# EAGLE board Farmduino_bêta (EAGLE 7.2.0)
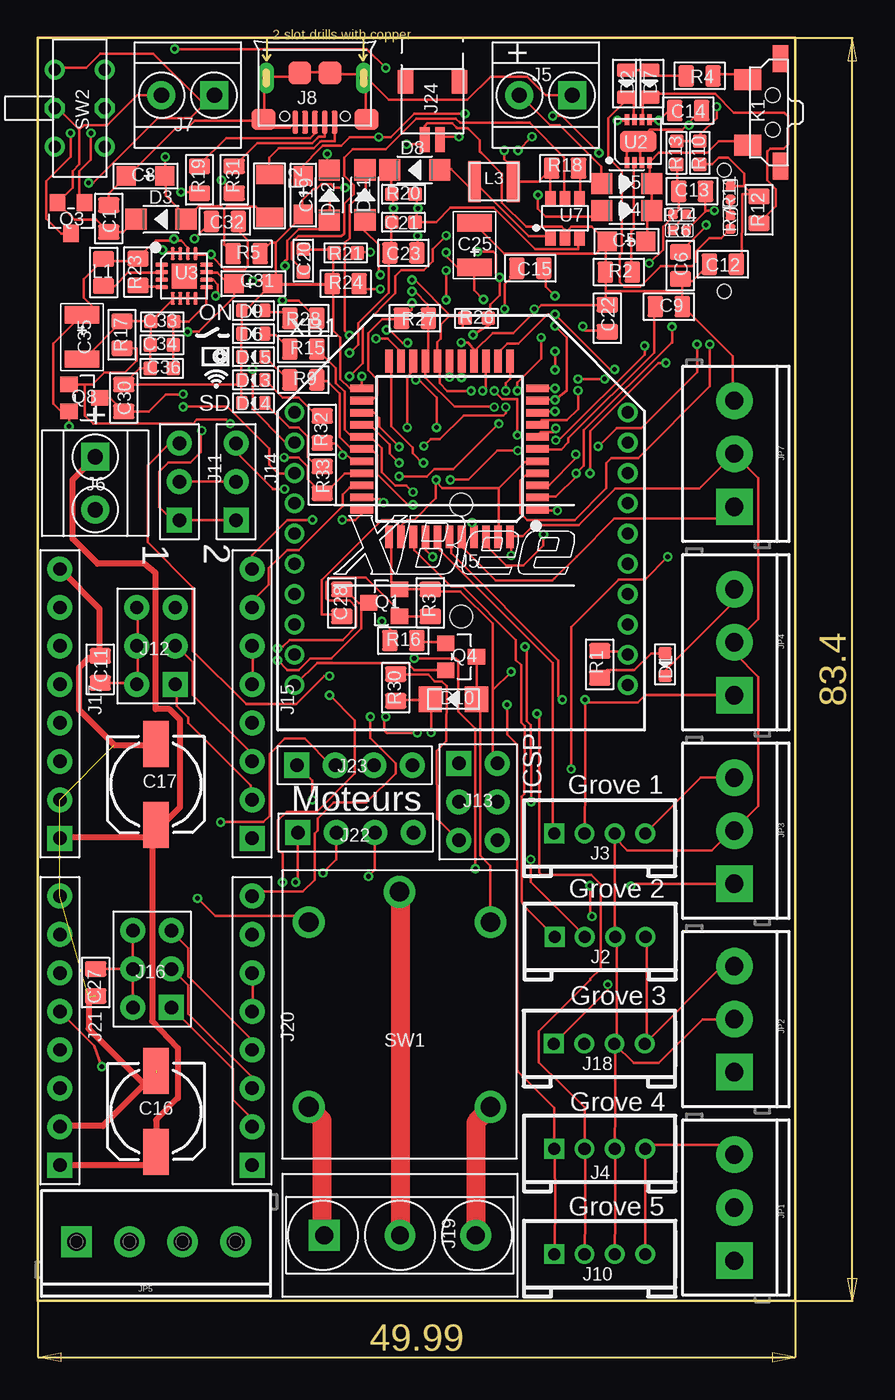
[diagram p1: board, top side]
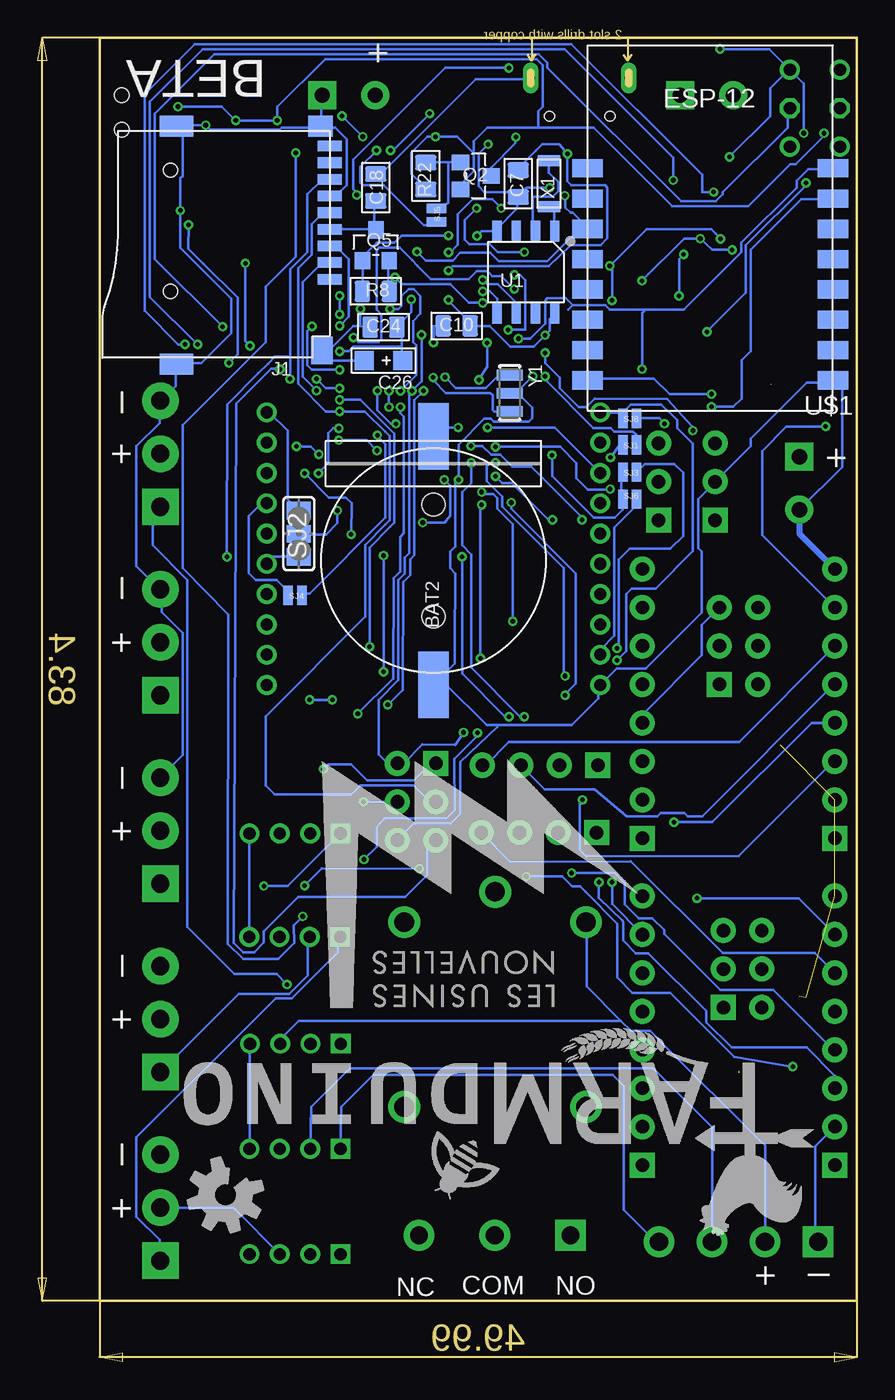
[diagram p2: board, bottom side, seen from below]

Size 49.99 x 83.4 mm. Coordinates in mm from the lower left corner, seen from the top.
Outline: 0,0 49.99,0 49.99,83.4 0,83.4 0,0
Copper layers (1*16): Top 0.035mm / dielectric 1.5mm / Bottom 0.035mm
Design rules "SeeedStudio_2layer_DRU_no_angle_20140221-1": minimum track width 6mil, minimum drill 12mil, track to track 6mil, track to pad 6mil, pad to pad 6mil, via to via 6mil, smd to smd 0mil, copper to edge 10mil, drill to drill 10mil, minimum pad ring 10mil, minimum via ring 6mil, stop-mask expansion 2mil, vias tented up to drill 100mil, thermal gap 10mil

## Footprints (pad centres in the part's own frame; a part is rotated, then mirrored left to right if it is on the bottom)
BAT2P-SMD-16.4-CR1220 = smd 2 x 4.4: + 0,-8.2; - 0,8.2 | hole 1.5: 0,3.7; 0,-3.7
C0805 = smd 1.397 x 1.016: 1 0,0.889; 2 0,-0.889
AVX-A = smd 1.27 x 1.27: + -1.27,0; - 1.27,0
ELECTRO-SMD-C-6MM = smd 3.048 x 1.651: + 2.667,0; - -2.667,0
C0603 = smd 0.889 x 0.889: 1 0,0.762; 2 0,-0.762
AVX-B = smd 1.143 x 2.286: + -1.46,0; - 1.46,0
LED-0603 = smd 0.762 x 0.889: + -0.762,0; - 0.762,0
LED-0805 = smd 0.889 x 1.27: + -0.889,0; - 0.889,0
SOD-123 = smd 1.397 x 1.397: + -1.651,0; - 1.651,0
LL-34 = smd 1.524 x 1.676: A -1.524,0; C 1.524,0
F1206 = smd 1.27 x 1.778: 1 -1.397,0; 2 1.397,0
MICRO-SD9+4P-SMD-16.1X14.5X1.85MM = smd 1.6 x 0.7: 1 0,2.25; 2 0,1.15; 3 0,0.05; 4 0,-1.05; 5 0,-2.15; 6 0,-3.25; 7 0,-4.35; 8 0,-5.45; 9 0,-6.55 | smd 1.6 x 1.4: G1 0.6,-7.85 | smd 2.2 x 1.4: G2 10.1,-7.85; G3 10.1,7.85 | smd 1.4 x 1.8: G4 0.5,6.95 | hole 0.9: 10.5,-4.95; 10.5,3.05
HW4-2.0 = drill 0.8 pad 1.27 square: 1 -3,0 | drill 0.8 pad 1.27: 2 -1,0; 3 1,0; 4 3,0
H2-3.5-7.0X7.0MM = drill 1 pad 1.85 square: 1 -1.75,0 | drill 1 pad 1.85: 2 1.75,0
MICRO-USB5+4P-SMD-0.65-B = smd 0.381 x 1.524: 1 -1.3,-0.25; 2 -0.65,-0.25; 3 0,-0.25; 4 0.65,-0.25; 5 1.3,-0.25 | smd 1.6 x 1.397: S1 -3.4,-0.427; S6 3.4,-0.427 | drill 0.508 pad 1.016 long: S2 -3.226,-3.175; S5 3.226,-3.175 | smd 1.5 x 1.5: S3 -1,-3.5; S4 1,-3.5 | hole 0.635: -2,-0.65; 2,-0.65
H3-2.54 = drill 0.889 pad 1.651 square: 1 0,2.54 | drill 0.889 pad 1.651: 2 0,0; 3 0,-2.54
H2X3-2.54 = drill 0.889 pad 1.651 square: 1 -1.27,2.54 | drill 0.889 pad 1.651: 2 -1.27,0; 3 -1.27,-2.54; 4 1.27,-2.54; 5 1.27,0; 6 1.27,2.54
H8-2.54 = drill 0.889 pad 1.651 square: 1 0,8.89 | drill 0.889 pad 1.651: 2 0,6.35; 3 0,3.81; 4 0,1.27; 5 0,-1.27; 6 0,-3.81; 7 0,-6.35; 8 0,-8.89
H3-5.0-15.5X8.0MM = drill 1.168 pad 2.032 square: 1 0,5 | drill 1.168 pad 2.032: 2 0,0; 3 0,-5
H4-2.54 = drill 0.889 pad 1.651 square: 1 0,3.81 | drill 0.889 pad 1.651: 2 0,1.27; 3 0,-1.27; 4 0,-3.81
HW2-SMD-1.0-90D = smd 1.524 x 1.016: 3 -3.429,1.778; 4 -3.429,-1.778 | smd 1.651 x 0.635: + 0.381,0.508; - 0.381,-0.508
SCREWTERMINAL-3.5MM-3 = drill 1.2 pad 2.413 square: 1 0,0 | drill 1.2 pad 2.413: 2 3.5,0; 3 7,0
SCREWTERMINAL-3.5MM-4 = drill 1.2 pad 2.032 square: 1 0,0 | drill 1.2 pad 2.032: 2 3.5,0; 3 7,0; 4 10.5,0
SW4-SMD-7.0X3.5X3.5MM-90D = smd 1.397 x 1.778: 1 -2.159,1.651; 2 2.159,1.651 | smd 1.778 x 1.016: S1 -3.556,-0.508; S2 3.556,-0.508 | hole 0.95: -1.15,0; 1.15,0
L0805 = smd 1.016 x 1.397: 1 -0.889,0; 2 0.889,0
L1210 = smd 0.85 x 2.7: 1 -1.275,0; 2 1.275,0
SOT-23 = smd 1.016 x 1.143: 1 -0.889,-1.016; 2 0.889,-1.016; 3 0,1.016
R0805 = smd 1.397 x 1.016: 1 0,0.889; 2 0,-0.889
R0402 = smd 0.635 x 0.635: 1 0,0.445; 2 0,-0.445
R0603 = smd 0.889 x 0.889: 1 0,0.762; 2 0,-0.762
PAD-JUMPER-2-NO_NO_SILK = smd 0.635 x 1.27: 1 -0.45,0; 2 0.45,0
PAD-JUMPER-3-2OF3_NC_BY_TRACE_YES_SILK_LARGE = smd 1.168 x 1.6: 1 -1.524,0; 2 0,0; 3 1.524,0
REY5-19.0X15.0X15.0MM = drill 1.3 pad 2.1: 1 -8.1,0; 2 -6.1,-6; 3 -6.1,6; 4 6.1,-6; 5 6.1,6
SW6-2.54-9.0X3.5X3.2MM-90D = drill 0.813 pad 1.27: CH1A -2.54,-1.65; CH1B 2.54,-1.65; CH2A -2.54,1.65; CH2B 2.54,1.65 | drill 0.813 pad 1.27 octagon: COM1 0,-1.65; COM2 0,1.65
SOIC8-1.27-5X4MM = smd 0.6 x 1.4: 1 -1.905,-2.7; 2 -0.635,-2.7; 3 0.635,-2.7; 4 1.905,-2.7; 5 1.905,2.7; 6 0.635,2.7; 7 -0.635,2.7; 8 -1.905,2.7
DFN8G-0.5-3X3MM = smd 0.3 x 0.727: 1 -0.75,-1.413; 2 -0.25,-1.413; 3 0.25,-1.413; 4 0.75,-1.413; 5 0.75,1.413; 6 0.25,1.413; 7 -0.25,1.413; 8 -0.75,1.413 | smd 2.413 x 1.397: HEAT 0,0
QFN16G-0.5-3X3MM = smd 0.85 x 0.28: 1 -1.475,0.75; 2 -1.475,0.25; 3 -1.475,-0.25; 4 -1.475,-0.75; 9 1.475,-0.75; 10 1.475,-0.25; 11 1.475,0.25; 12 1.475,0.75 | smd 0.28 x 0.85: 5 -0.75,-1.475; 6 -0.25,-1.475; 7 0.25,-1.475; 8 0.75,-1.475; 13 0.75,1.475; 14 0.25,1.475; 15 -0.25,1.475; 16 -0.75,1.475 | smd 1.65 x 1.65: PAD 0,0
TQFP44-0.8-9.6X9.6MM = smd 1.5 x 0.5: 1 -5.8,4; 2 -5.8,3.2; 3 -5.8,2.4; 4 -5.8,1.6; 5 -5.8,0.8; 6 -5.8,0; 7 -5.8,-0.8; 8 -5.8,-1.6; 9 -5.8,-2.4; 10 -5.8,-3.2; 11 -5.8,-4; 23 5.8,-4; 24 5.8,-3.2; 25 5.8,-2.4; 26 5.8,-1.6; 27 5.8,-0.8; 28 5.8,0; 29 5.8,0.8; 30 5.8,1.6; 31 5.8,2.4; 32 5.8,3.2; 33 5.8,4 | smd 0.5 x 1.5: 12 -4,-5.8; 13 -3.2,-5.8; 14 -2.4,-5.8; 15 -1.6,-5.8; 16 -0.8,-5.8; 17 0,-5.8; 18 0.8,-5.8; 19 1.6,-5.8; 20 2.4,-5.8; 21 3.2,-5.8; 22 4,-5.8; 34 4,5.8; 35 3.2,5.8; 36 2.4,5.8; 37 1.6,5.8; 38 0.8,5.8; 39 0,5.8; 40 -0.8,5.8; 41 -1.6,5.8; 42 -2.4,5.8; 43 -3.2,5.8; 44 -4,5.8
SOT-23-6 = smd 0.69 x 1: 1 -0.95,-1.3; 2 0,-1.3; 3 0.95,-1.3; 4 0.95,1.3; 5 0,1.3; 6 -0.95,1.3
ESP8266-ESP12 = smd 2 x 1.2: 1 16.2,2; 2 16.2,4; 3 16.2,6; 4 16.2,8; 5 16.2,10; 6 16.2,12; 7 16.2,14; 8 16.2,16; 9 0,16; 10 0,14; 11 0,12; 12 0,10; 13 0,8; 14 0,6; 15 0,4; 16 0,2
X2-SMD-3.2X1.5X0.55MM = smd 0.762 x 1.524: 1 -1.524,0; 2 1.524,0
XBEE = drill 0.8 pad 1.27: 1 -11,9; 2 -11,7; 3 -11,5; 4 -11,3; 5 -11,1; 6 -11,-1; 7 -11,-3; 8 -11,-5; 9 -11,-7; 10 -11,-9; 11 11,-9; 12 11,-7; 13 11,-5; 14 11,-3; 15 11,-1; 16 11,1; 17 11,3; 18 11,5; 19 11,7; 20 11,9
X3-SMD-3.6X1.3X0.8MM = smd 0.7 x 1.7: 1 -1.2,0; 2 0,0; 3 1.2,0

## Placement (x,y rotation side)
BAT2  [BAT2P-SMD-16.4-CR1220]  27.94,48.88 180 bottom
C1  1uF  [C0805]  4.68,71.46 0 top
C5  10uF  [AVX-A]  38.86,69.96 180 top
C6  100nF  [C0805]  42.42,68.36 0 top
C7  100nF  [C0805]  22.35,73.77 180 bottom
C8  10uF  [AVX-A]  7.11,74.28 180 top
C9  1uF  [C0805]  41.66,65.64 90 top
C10  100NF  [C0805]  26.42,64.37 90 bottom
C11  100NF  [C0805]  4.12,41.69 0 top
C12  22pF  [C0805]  45.21,68.45 270 top
C13  100nF  [C0805]  43.18,73.26 90 top
C14  1uF  [C0805]  42.93,78.6 270 top
C15  100nF  [C0805]  32.51,68.18 270 top
C16  100uF  [ELECTRO-SMD-C-6MM]  7.8,12.51 270 top
C17  100uF  [ELECTRO-SMD-C-6MM]  7.8,34.1 270 top
C18  1uF  [C0805]  31.75,73.52 0 bottom
C19  10uF  [AVX-A]  17.53,73.01 270 top
C20  33nF  [C0603]  17.53,68.69 0 top
C21  1nF  [C0603]  24.13,71.23 270 top
C22  1uF  [C0805]  37.59,64.88 0 top
C23  10nF  [C0805]  24.13,69.2 270 top
C24  100nF  [C0805]  31.24,64.3 90 bottom
C25  100uF  [AVX-B]  28.83,69.71 90 top
C26  10uF  [AVX-A]  31.24,62.09 180 bottom
C27  100NF  [C0805]  3.81,21.02 180 top
C28  100NF-50V  [C0805]  20.07,46.09 180 top
C30  100NF-50V  [C0805]  5.67,59.62 0 top
C31  10UF  [AVX-A]  14.22,67.17 0 top
C32  100NF  [C0805]  12.34,71.28 270 top
C33  2.2NF  [C0603]  8.21,64.65 90 top
C34  1NF  [C0603]  8.18,63.13 90 top
C35  22UF  [AVX-B]  2.91,63.64 270 top
C36  100PF  [C0603]  8.18,61.57 90 top
D1  LED ROUGE  [LED-0603]  41.4,42.02 270 top
D2  Jaune  [LED-0805]  38.86,80.38 270 top
D3  B5819W  [SOD-123]  8.13,71.42 180 top
D4  B5819W  [SOD-123]  38.86,71.99 0 top
D5  B5819W  [SOD-123]  38.86,73.77 0 top
D6  Rouge  [LED-0603]  14.22,63.87 180 top
D7  Vert  [LED-0805]  40.39,80.38 270 top
D8  B5819W  [SOD-123]  24.87,74.67 180 top
D9  Vert  [LED-0603]  14.22,65.39 180 top
D10  1N4148  [LL-34]  27.43,39.74 180 top
D11  B5819W  [SOD-123]  21.59,73.03 90 top
D12  B5819W  [SOD-123]  19.23,73 90 top
D13  Bleu  [LED-0603]  14.22,60.82 180 top
D14  Jaune  [LED-0603]  14.22,59.29 180 top
D15  Rouge  [LED-0603]  14.22,62.34 180 top
F2  1000MA  [F1206]  15.3,72.96 270 top
J1  MICRO-SD  [MICRO-SD9+4P-SMD-16.1X14.5X1.85MM]  34.8,69.71 180 bottom
J2  [HW4-2.0]  37.11,24.04 0 top
J3  [HW4-2.0]  37.08,30.87 0 top
J4  [HW4-2.0]  37.08,10.04 0 top
J5  Panneau Photo  [H2-3.5-7.0X7.0MM]  33.53,79.61 180 top
J6  V EXT  [H2-3.5-7.0X7.0MM]  3.78,53.99 270 top
J7  On/OFF Ext  [H2-3.5-7.0X7.0MM]  9.91,79.61 180 top
J8  [MICRO-USB5+4P-SMD-0.65-B]  18.29,77.58 180 top
J10  [HW4-2.0]  37.08,3.08 0 top
J11  [H3-2.54]  9.35,54.09 180 top
J12  Choix Mode  [H2X3-2.54]  7.8,43.24 180 top
J13  [H2X3-2.54]  29.06,32.95 0 top
J14  [H3-2.54]  13.08,54.09 180 top
J15  [H8-2.54]  14.15,39.43 180 top
J16  Choix Mode  [H2X3-2.54]  7.54,21.91 180 top
J17  [H8-2.54]  1.45,39.43 180 top
J18  [HW4-2.0]  37.06,16.98 0 top
J19  Relais  [H3-5.0-15.5X8.0MM]  23.9,4.33 90 top
J20  [H8-2.54]  14.15,17.84 180 top
J21  [H8-2.54]  1.45,17.84 180 top
J22  [H4-2.54]  20.98,30.92 90 top
J23  [H4-2.54]  20.9,35.37 90 top
J24  Batterie 3.7V  [HW2-SMD-1.0-90D]  26.04,77.06 270 top
JP1  [SCREWTERMINAL-3.5MM-3]  45.97,2.65 90 top
JP2  [SCREWTERMINAL-3.5MM-3]  45.97,15.1 90 top
JP3  [SCREWTERMINAL-3.5MM-3]  45.97,27.54 90 top
JP4  [SCREWTERMINAL-3.5MM-3]  45.97,39.99 90 top
JP5  [SCREWTERMINAL-3.5MM-4]  2.55,3.89 0 top
JP7  [SCREWTERMINAL-3.5MM-3]  45.97,52.44 90 top
K1  [SW4-SMD-7.0X3.5X3.5MM-90D]  48.51,78.47 90 top
L1  2.2 UH  [L0805]  4.34,67.9 90 top
L3  10uH  [L1210]  30.1,73.9 180 top
LOGO1  OSHW-LOGOM  [OSHW-LOGO-M]  41.67,7 150 bottom
Q1  MOSFET P  [SOT-23]  22.86,46.09 90 top
Q2  MOSFET P  [SOT-23]  25.15,74.28 270 bottom
Q3  MOSFET P  [SOT-23]  2.18,71.49 180 top
Q4  S9013  [SOT-23]  27.94,42.53 270 top
Q5  MOSFET P  [SOT-23]  31.75,69.71 0 bottom
Q8  MOSFET P  [SOT-23]  3.07,59.62 270 top
R1  1k  [R0805]  37.08,42.02 180 top
R2  2k  [R0805]  38.35,67.93 270 top
R3  10k  [R0805]  25.91,46.09 0 top
R4  2k  [R0805]  43.69,80.88 90 top
R5  100k  [R0805]  13.78,69.15 270 top
R6  1M  [R0402]  42.35,70.68 270 top
R7  1M  [R0402]  45.72,71.23 180 top
R8  10k  [R0805]  31.75,66.66 90 bottom
R9  1k  [R0805]  17.53,60.82 270 top
R10  10M  [R0603]  43.69,75.8 180 top
R11  1M  [R0402]  45.72,73.16 180 top
R12  1M  [R0805]  47.6,72.04 180 top
R13  10M  [R0603]  42.16,75.8 180 top
R14  1M  [R0402]  42.36,71.74 270 top
R15  1k  [R0805]  17.53,62.85 270 top
R16  10k  [R0805]  24.13,43.6 90 top
R17  10k  [R0805]  5.55,63.8 180 top
R18  4.7k  [R0805]  34.8,74.79 90 top
R19  22R  [R0805]  10.67,74.03 0 top
R20  6.8k  [R0603]  24.13,73.07 270 top
R21  1.8k  [R0603]  20.32,69.2 90 top
R22  10k  [R0805]  28.45,74.28 0 bottom
R23  100k  [R0805]  6.6,67.93 180 top
R24  10k  [R0805]  20.32,67.17 270 top
R26  2k  [R0603]  28.96,64.88 270 top
R27  2k  [R0805]  24.89,64.88 90 top
R28  1k  [R0805]  17.53,64.88 90 top
R30  10k  [R0805]  23.62,40.5 0 top
R31  22R  [R0805]  12.95,74.03 0 top
R32  1k  [R0805]  18.77,57.54 0 top
R33  1k  [R0805]  18.77,54.21 180 top
SJ1  JUMPER  [PAD-JUMPER-2-NO_NO_SILK]  14.99,56.53 0 bottom
SJ2  [PAD-JUMPER-3-2OF3_NC_BY_TRACE_YES_SILK_LARGE]  36.83,50.66 90 bottom
SJ3  JUMPER  [PAD-JUMPER-2-NO_NO_SILK]  14.99,54.72 0 bottom
SJ4  JUMPER  [PAD-JUMPER-2-NO_NO_SILK]  37.08,46.59 0 bottom
SJ5  JUMPER  [PAD-JUMPER-2-NO_NO_SILK]  27.74,71.69 90 bottom
SJ6  JUMPER  [PAD-JUMPER-2-NO_NO_SILK]  14.99,52.94 0 bottom
SJ8  JUMPER  [PAD-JUMPER-2-NO_NO_SILK]  14.99,58.28 0 bottom
SW1  [REY5-19.0X15.0X15.0MM]  23.88,18.91 270 top
SW2  [SW6-2.54-9.0X3.5X3.2MM-90D]  2.77,78.75 270 top
U1  DS1337S+  [SOIC8-1.27-5X4MM]  21.84,67.93 180 bottom
U2  CN3065  [DFN8G-0.5-3X3MM]  39.62,76.57 0 top
U3  TPS62132RGTR  [QFN16G-0.5-3X3MM]  9.65,67.68 0 top
U5  [TQFP44-0.8-9.6X9.6MM]  27.18,56.25 180 top
U7  AIC1896CG  [SOT-23-6]  34.8,71.49 0 top
U$1  ESP8266_ESP-12  [ESP8266-ESP12]  17.78,58.79 0 bottom
X1  32.768 KHz  [X2-SMD-3.2X1.5X0.55MM]  20.32,73.77 90 bottom
XB1  XBEE  [XBEE]  27.94,49.67 0 top
Y1  [X3-SMD-3.6X1.3X0.8MM]  22.91,59.93 270 bottom

## Tracks (layer width: path | path; a pad name or v marks a point on that pad's centre or on a via)
!SHDN
  Top 0.152: U7.4 35.81,72.91 35.81,74.74 R18.2
+3V3  (via drill 0.3)
  Top 0.152: 25.91,39.68 25.45,39.68 | 25.45,39.68 23.62,39.68 R30.2 | 25.91,39.68 D10.C 25.45,39.68 | U5.24 21.49,59.5 22.1,59.5 22.4,59.8 22.4,60.84 21.79,61.45 21.79,63.89 22.73,64.83 23.93,64.83 R27.1 24.08,64.98 24.69,65.44 v24.69,65.9 | v16.16,66.05 17.22,66.05 18.29,64.98 R28.2 | v16.31,68.34 16.31,68.64 16.46,68.79 16.46,70.01 17.22,70.78 18.75,70.78 19.51,71.54 D12.+ 19.51,71.69 19.28,71.59 v19.28,72.98 | 8.99,70.01 7.77,70.01 6.71,68.95 R23.2 6.55,68.79 6.4,68.64 4.37,68.64 L1.2 3.02,67.47 3.02,66.23 3.91,65.34 C35.+ 1.03,63.22 1.03,59.25 1.54,58.73 Q8.2 v2.06,57.74 | 8.99,70.01 9.45,70.01 9.91,69.56 9.91,69.25 U3.14 | 8.99,70.01 v8.99,70.12 | J10.3 38.1,5.7 38.1,10.45 J4.3 38.1,12.86 38.1,16.94 J18.3 | 45.87,55.84 45.95,55.92 | 45.87,55.84 43.66,53.64 38.1,53.64 35.71,51.24 32.74,51.24 32,50.51 31.24,50.51 U5.44 31.24,50.38 v31.24,49.21 | 45.87,55.84 JP7.2 45.95,55.92 | U5.34 23.32,50.35 23.32,47.46 23.78,47 Q1.2 23.93,47 25.91,47 R3.1 25.91,46.85 27.89,46.85 30.02,44.71 30.02,40.32 | v29.36,60.08 29.57,60.28 29.57,61.93 U5.14 | 30.02,40.32 30.02,35.72 J13.6 | 45.95,55.92 47.55,54.31 47.55,45.02 46.03,43.49 JP4.2 46.03,43.34 46.03,42.73 47.55,41.21 47.55,32.68 46.03,31.15 JP3.2 45.87,31.15 44.48,29.75 38.91,29.75 38.08,30.58 J3.3 38.08,24.06 J2.3 38.23,23.94 38.23,17.15 J18.3 | v10.54,26.58 11.71,25.41 17.5,25.41 17.9,25.01 SW1.2 | v28.73,63.79 29.85,64.45 R26.1 29.87,64.98 29.87,65.8 30.48,66.41 v30.48,67.57 30.23,67.83 30.23,69.12 30.07,69.28 v29.03,69.28 | 25.91,39.68 26.11,39.48 26.09,39.48 25.96,39.35 v25.96,37.53 | JP2.2 43.89,18.6 41,15.71 39.33,15.71 J18.3
  Top 0.152: v31.24,41.54 30.02,40.32
  Bottom 0.152: 30.94,67.57 30.94,68.64 Q5.2 | 30.94,67.57 30.94,66.66 R8.2 | 30.94,67.57 v30.48,67.57 30.05,67.14 26.85,67.14 25.6,65.9 v24.69,65.9 | v16.16,66.05 16.16,68.18 v16.31,68.34 13.87,70.77 9.59,70.77 9.3,70.47 8.99,70.15 v8.99,70.12 | 17.98,71.08 18.75,71.84 18.9,71.84 19.23,72.19 19.23,72.77 v19.28,72.98 | 17.98,71.08 17.83,70.93 U$1.11 17.98,71.08 | v29.03,69.28 28.45,68.69 26.67,68.69 26.16,69.2 24.18,69.2 23.62,68.64 20.42,68.64 17.98,71.08 | JP1.2 45.87,6.16 41.17,6.16 41,5.99 J10.3 | J21.7 3.84,26.58 v10.54,26.58 | v28.73,63.79 28.73,60.72 v29.36,60.08 29.54,59.9 29.54,49.39 29.85,49.08 29.85,48.02 30.28,47.58 30.28,40.98 31.57,39.68 31.55,36.08 30.96,35.49 J13.6 29.92,35.49 28.68,36.74 26.52,36.71 v25.96,37.53 | J17.7 6.23,50.57 6.23,56.13 4.64,57.72 v2.06,57.74 | 15.57,18.5 36.83,18.5 38.06,17.27 J18.3 | 17.98,25.05 17.94,25.01 SW1.2 17.83,24.93 17.83,20.76 15.57,18.5 | v31.24,49.21 v31.24,41.54 | 15.57,18.5 14.89,17.82 13.64,17.82 12.8,16.98 6.4,10.6 6.05,10.26 JP5.2
A7
  Top 0.152: R10.1 44.5,75.04 44.96,75.5 45.57,75.5 46.64,74.43 46.64,73.62 | C12.1 46.48,68.43 46.48,69.95 46.48,71.08 46.48,73.06 47.24,73.06 R12.2 47.33,72.93 46.63,73.62 46.64,73.62 | R11.2 46.64,73.62
BAT  (via drill 0.3)
  Top 0.152: R13.2 R10.2 43.74,76.57 43.74,77.02 44.81,78.09 v44.81,78.85 | v38.25,77.94 38.86,77.94 U2.8 | U2.5 40.39,77.94 v41,77.94 41.61,78.55 41.91,78.55 C14.2 | v2.16,77.1 2.16,75.56 0.56,73.95 0.55,71.47 1.55,70.48 Q3.3 | v27.8,76.87 26.54,76.87 J24.+
  Bottom 0.152: v44.81,78.85 41.91,78.85 v41,77.94 v38.25,77.94 38.25,78.85 35.1,82 21.13,82 20.73,81.59 20.73,78.85 21.03,78.55 21.03,77.48 | v2.16,77.1 2.13,76.95 4.01,75.07 4.39,75.07 7.16,72.3 12.19,72.3 17.37,77.48 21.03,77.48 | 21.03,77.48 24.38,77.48 25.29,76.58 25.29,75.78 | Q2.2 26.06,73.52 26.06,73.82 25.29,74.59 25.29,75.78 | R22.2 28.5,73.52 29.41,74.43 29.41,75.8 28.35,76.87 28.34,76.87 v27.8,76.87 26.38,76.87 25.29,75.78
BEE_3V3  (via drill 0.3)
  Top 0.152: 21.34,46.09 21.18,46.09 20.42,46.85 20.12,46.85 C28.2 | 21.34,46.09 Q1.3 21.79,46.09 | 21.34,46.09 21.34,44.41 19.36,42.43 17.98,42.43 17.22,41.67 16.46,41.67 v15.82,42.3
  Bottom 0.152: v15.82,42.3 15.22,42.91 15.22,46.67 14.86,47.03 13.28,47.03 10.82,49.51 10.82,56.6 11.86,57.64 11.86,58.15 12.9,59.19 14.94,59.19 15.39,58.73 15.39,58.28 SJ8.1 | SJ8.1 15.8,58.64 | XB1.1 15.44,58.67 SJ8.1
BEE_CTS
  Top 0.152: 38.86,42.73 38.71,42.88 37.19,42.88 R1.2 | 38.86,42.73 38.86,42.72 | 38.86,42.73 38.87,42.73 XB1.12
BEE_EN  (via drill 0.3)
  Top 0.152: 20.27,55.99 20.73,55.54 21.34,55.54 U5.29 | 20.27,55.99 19.66,56.6 19.05,56.6 R32.2 | 20.27,55.99 v20.12,55.84
  Bottom 0.152: SJ6.1 15.55,52.94 15.55,54.62 SJ3.1 | v20.12,55.84 20.12,54.47 17.37,51.73 15.98,51.73 15.44,52.26 SJ6.1 | 15.39,52.94 SJ6.1
BEE_RI  (via drill 0.3)
  Top 0.152: v34.29,52.18 33.07,52.18 U5.1
  Bottom 0.152: 36.93,50.76 SJ2.2 36.78,50.61 35.03,50.61 34.29,51.34 v34.29,52.18
CH
  Top 0.152: 39.02,79.46 39.32,79.16 39.32,78.09 U2.7 | 39.02,79.46 37.64,78.09 37.64,75.5 38.56,74.59 38.56,69.25 38.41,69.1 38.41,67.27 38.71,66.97 39.78,66.97 41.13,68.32 43.15,68.32 43.43,68.6 43.43,69.29 44.32,70.17 45.1,70.16 R7.1 | 39.02,79.46 D2.-
D6
  Top 0.152: D1.+ 41.3,42.73 40.49,42.73 39.37,41.64 37.59,41.64 37.19,41.21 R1.1
D+
  Top 0.152: R19.1 10.67,75.02 12.43,76.78 17.97,76.78 18.3,77.12 18.3,77.82 J8.3
D-
  Top 0.152: J8.2 18.9,77.78 18.92,77.36 18.93,76.88 18.55,76.88 18.44,76.78 18.11,76.45 14.49,76.45 R31.1
DIR1  (via drill 0.3)
  Top 0.152: v25.45,55.33 25.45,55.26 24.74,55.97 24.74,56.35 23.32,57.77 23.32,61.93 U5.22 | 14.2,26.63 J20.8 14.45,27.04 17.5,27.04 18.26,27.8 18.26,30.85 18.47,31.05 18.47,31.84 19.53,32.9 21.69,32.9 23.62,34.83 23.62,35.49 21.95,37.17 v21.95,38.57
  Bottom 0.152: v25.45,55.33 25.45,54.01 26.06,53.4 26.06,49.9 25.45,49.29 25.45,41.82 22.2,38.57 v21.95,38.57
DIR2  (via drill 0.3)
  Top 0.152: v30.89,60.08 30.89,60.62 31.17,60.89 31.17,61.88 31.12,61.93 31.09,61.93 U5.12 | v18.14,51.57 16.46,51.57 14.15,49.26 J15.8 | v30.89,59.01 30.89,58.61 30.73,58.46 28.12,58.46 26.54,56.91 25.93,56.91 v25.48,56.45
  Bottom 0.152: v30.89,59.01 v30.89,60.08 | v18.14,51.57 18.16,51.57 18.16,51.75 21.49,55.08 22.76,55.08 23.55,55.87 24.13,55.87 24.71,56.45 v25.48,56.45
G1A
  Top 0.152: U5.36 24.84,50.35 24.84,49.59 27.28,47.15 28.04,47.15 31.55,43.65 31.55,42.33 31.9,41.97 31.9,38.19 32.13,37.96 32.11,33.46 31.95,33.31 31.95,26.4 32.11,26.04 32.28,25.87 J2.1 34.11,24.09
  Bottom 0.152: JP1.1 46.03,2.65 46.03,4.02 47.55,5.55 47.55,10.78 38.35,19.98 37.31,19.98 34.27,23.02 34.27,23.94 J2.1
G1B  (via drill 0.3)
  Top 0.152: v26.06,49.13 25.6,49.59 25.6,50.35 U5.37 | v22.96,38.57 22.89,38.47 22.86,38.44 22.86,37.7 23.04,37.5 v25.05,37.5 | 36.09,24.09 36.22,23.99 | 32.41,29.22 v32.54,29.14 32.54,27.65 36.09,24.09 | 36.09,24.09 J2.2
  Bottom 0.152: v26.06,49.13 26.06,41.41 23.22,38.57 v22.96,38.57 | 45.87,15.15 JP2.1 40.79,20.28 37.47,20.28 36.25,21.5 36.25,23.94 J2.2 | v32.54,29.14 31.67,29.98 31.67,31.28 31.19,31.86 27.1,31.86 26.54,32.42 26.57,35.77 24.94,37.4 v25.05,37.5
G2A  (via drill 0.3)
  Top 0.152: U5.38 26.52,50.35 26.52,49.59 33.98,42.12 33.98,30.92 34.09,30.82 J3.1 | v39.14,27.39 39.29,27.54 JP3.1
  Bottom 0.152: J3.1 37.56,27.39 v39.14,27.39
G2B  (via drill 0.3)
  Top 0.152: U5.39 27.28,50.35 27.28,49.36 34.37,42.28 34.37,39.94 v34.62,39.68 | J3.2 36.12,34.5 v36.12,39.68 36.12,39.66 36.27,39.51 39.6,39.51 40.08,39.99 JP4.1
  Bottom 0.152: v34.62,39.68 v36.12,39.68
G3A  (via drill 0.3)
  Top 0.152: JP7.1 45.19,51.65 38.05,51.65 35.56,49.13 34.09,47.69 33.96,47.56 30.23,47.56 28.04,49.74 28.04,50.35 U5.40 | v37.62,20.89 37.62,20.54 J18.1
  Bottom 0.152: JP7.1 46.03,52.33 46.48,51.88 46.48,49.9 44.2,47.61 44.2,24.67 41.1,21.57 38.3,21.57 v37.62,20.89
GND  (via drill 0.3)  (6 unrouted)
  Top 0.152: 25.2,69.76 25.18,69.69 C23.1 25.07,69.2 v25.07,70.32 | 42.52,67.32 42.52,66.66 | 42.52,66.66 42.52,65.75 C9.2 42.67,65.59 45.87,62.39 45.87,59.5 JP7.3 | 42.52,67.32 43.19,67.32 44.32,68.46 C12.2 | 42.52,67.32 C6.2 | 34.9,70.62 34.9,70.32 U7.2 34.9,70.62 | 34.9,70.62 35.2,70.93 36.58,70.93 37.49,70.01 C5.- | C5.- 37.49,69.86 37.49,68.03 R2.2 37.49,67.88 37.49,66.66 | 37.49,66.66 37.49,65.9 C22.1 37.49,65.75 33.22,65.75 32.92,65.44 | 28.86,62.75 30.02,63.92 31.4,63.92 32.92,65.44 | 28.86,62.75 28.8,62.7 28.8,62.09 U5.15 | 37.49,66.66 42.52,66.66 | 32.92,65.44 v32.77,65.49 | 29.26,75.8 29.26,75.81 | 29.26,75.8 30.63,74.43 30.63,72.53 32.23,70.93 34.59,70.93 34.9,70.62 | JP2.3 45.87,22.01 45.09,22.01 J18.4 40.21,17.13 40.21,23.94 J2.4 | 40.08,10.3 40.08,5.7 J10.4 | 40.08,10.3 J4.4 | 45.87,9.66 JP1.3 45.33,10.3 40.08,10.3 | D1.- 41.45,41.36 41.45,41.67 45.87,46.09 45.87,46.85 JP4.3 | 45.87,34.5 JP3.3 43.76,34.54 J3.4 | 30.43,53.68 30.43,50.48 U5.43 | U5.5 32.92,55.38 32.13,55.38 30.43,53.68 | Q4.2 26.82,41.67 24.84,41.67 24.38,42.12 18.44,42.12 17.07,40.75 17.03,40.75 XB1.10 | C28.1 19.97,45.32 18.75,45.32 18.75,47.61 22.71,51.57 23.47,51.57 23.93,51.12 | 23.93,51.12 23.93,50.51 U5.35 23.93,51.12 | 30.43,53.68 26.7,53.68 26.29,54.09 v26.29,54.21 26.28,53.92 26.28,53.01 24.84,51.57 24.38,51.57 23.93,51.12 | 39.32,76.26 38.86,75.8 38.86,75.19 U2.1 | 39.32,76.26 39.78,75.8 39.78,75.19 U2.3 | 39.32,76.26 U2.HEAT 40.39,77.33 42.52,77.33 42.98,77.78 | 42.98,77.78 43.74,78.55 C14.1 | 44.04,71.99 44.04,73.21 C13.2 | v44.65,71.99 44.04,71.99 | v42.98,77.63 42.98,77.78 | J8.5 16.92,77.78 16.61,77.48 15.39,77.48 14.94,77.94 J8.S6
  Top 0.152: J8.S6 14.94,78.09 14.94,80.68 J8.S5 15.09,80.83 17.07,80.83 17.22,80.99 J8.S4 17.37,81.14 19.2,81.14 J8.S3 19.36,80.99 21.34,80.99 21.49,80.83 J8.S2 | J8.S1 21.64,78.09 21.64,80.68 J8.S2 | J5.1 33.53,79.61 32.31,80.83 29.88,80.83 28.35,79.31 23.17,79.31 21.64,80.83 J8.S2 | C20.1 17.53,69.4 19.2,69.4 19.36,69.25 R21.1 | R24.2 19.51,67.27 19.51,69.1 R21.1 | R24.2 19.51,67.12 19.51,64.07 19.97,63.61 19.97,60.87 20.57,60.26 21.34,60.26 U5.23 21.39,60.26 v21.39,61.05 | U3.7 9.45,66.2 U3.6 9.3,66.2 8.99,66.2 U3.5 8.9,66.1 C33.1 | U3.7 10.36,66.2 U3.8 | U3.7 | C33.1 7.58,64.7 6.71,64.68 R17.2 3.05,62.18 C35.- | C33.1 7.45,63.18 C34.1 7.73,63.02 7.42,63.07 C36.1 6.74,61.58 C30.1 | C33.1 7.42,64.5 | D14.- 13.41,59.34 13.41,60.72 D13.- | D6.- 13.41,63.76 13.41,62.39 D15.- 13.41,62.24 13.41,60.87 D13.- | 13.56,63.92 D6.- | 15.7,69.86 17.53,71.69 C19.- 17.45,71.81 17.45,72.68 18.18,73.41 18.39,73.41 18.71,73.72 19.35,73.72 19.57,73.5 v20.27,73.5 | U3.15 9.3,69.25 8.99,69.25 U3.16 8.84,69.25 8.38,69.25 v8.23,69.4 | 15.55,67.27 C31.- | R24.2 19.36,67.12 15.55,67.12 C31.- | 4.06,42.53 C11.1 | 7.8,15.05 7.04,14.29 | 1.55,11.54 J21.2 | 7.8,36.69 C17.- | J8.S6 14.78,77.94 10.36,77.94 9.91,77.48 9.14,77.48 5.94,74.28 C8.- 4.68,73.12 C1.1 | U5.15 | J14.2 J11.2 | 28.83,70.8 C25.- 28.83,71.1 30.79,69.15 | 30.79,69.15 30.77,69.15 | 30.79,69.15 36.86,69.15 C5.- | v27.94,63.28 28.4,63.28 28.86,62.75 | C32.2 11.45,71.26 v10.33,70.14 | 15.7,69.86 15.38,69.86 R5.1 | 15.7,69.86 15.7,67.37 C31.- | R21.1 19.5,69.14 19.5,67.05 19.41,67.14 19.04,67.14 19.02,67.12 15.4,67.12 13.68,65.39 D9.- 13.41,65.29 13.46,65.24 D6.-
  Top 0.152: R21.1 19.48,69.13 19.48,67.18 19.44,67.13 15.45,67.13 15.23,67.36 v14.19,67.36 | R6.1 44.04,71.93 44.04,71.99 | J24.- 25.23,76.37 v24.34,76.37 25.44,76.37 25.55,76.48 25.55,77.56 25.7,77.76 27.36,77.76 | 27.61,77.51 | 29.26,75.8 29.17,75.89 29.17,76.66 28.43,77.4 28.39,77.44 27.68,77.44 27.61,77.51 | 27.61,77.51 | 27.61,77.51 27.36,77.76 | 27.36,77.76 | 5.65,60.51 5.66,60.49 13.14,60.49 D13.-
  Top 0.406: 4.06,42.53 4.06,45.7 1.55,48.27 J17.8 | 1.55,11.54 4.29,11.54 7.04,14.29 3.35,17.97 3.35,20.02 | 7.8,36.69 5.05,36.69 2.72,39.02 2.72,41.82 3.38,42.48 C11.1
  Bottom 0.152: 22.4,72.76 22.4,72.15 23.78,70.78 U1.4 24.76,70.63 v25.07,70.32 | 22.4,72.76 C7.1 22.43,73.21 24.59,73.21 24.96,73.59 24.96,75.75 v24.34,76.37 | C26.- 34.59,62.09 35.05,62.54 | 35.05,62.54 35.2,62.7 J1.G4 35.05,62.54 | 32.77,64.37 33.22,64.37 35.05,62.54 | 32.77,64.37 C24.1 | v32.77,65.49 32.77,64.37 | J4.4 40.08,12.86 40.08,16.95 J18.4 | 40.21,24.09 J2.4 40.11,30.36 40.08,30.39 J3.4 | JP3.3 45.87,34.66 44.5,36.03 44.5,44.1 45.87,45.48 45.87,46.85 JP4.3 46.03,47 47.55,48.52 47.55,56.45 46.03,57.97 46.03,59.34 JP7.3 45.87,59.5 44.96,60.41 44.96,61.78 J1.G3 44.81,61.93 43.28,61.93 41.3,63.92 41.3,66.18 44.65,69.56 v44.65,71.99 44.65,74.13 44.5,74.28 44.5,77.18 44.81,77.48 J1.G2 44.81,77.63 v42.98,77.63 42.67,77.33 38.1,77.33 37.95,77.48 35.51,77.48 J1.G1 | C10.1 27.94,64.37 v27.94,63.28 | J1.6 34.75,73.06 34.29,73.06 33.68,73.67 33.68,76.72 34.44,77.48 35.36,77.48 J1.G1 | J1.G1 35.36,77.63 35.36,79.61 J5.1 | C18.1 31.7,74.43 31.4,74.43 25.15,80.68 21.64,80.68 J8.S2 | v8.23,69.4 9.56,69.4 v10.33,70.14 11.41,70.14 v14.19,67.36 13.75,67.79 | 1.68,60.72 U$1.1 | J21.2 2.74,10.2 2.74,4.08 JP5.1 2.74,4.02 | J6.2 0.95,55.07 0.95,60.44 1.29,60.79 U$1.1 | 23.72,38.01 24.44,38.01 27.15,40.73 27.43,40.75 27.94,40.75 BAT2.- 26.53,42.09 26.53,43.29 26.49,48.02 26.85,48.37 26.85,49.46 26.52,49.79 26.52,53.98 v26.29,54.21 26.29,56.55 24.59,58.25 24.16,58.25 23.95,58.05 21.67,58.05 21.44,58.28 21.44,58.99 22.38,59.93 | 23.72,38.01 18.82,38.01 17.07,39.76 17.07,40.6 16.98,40.6 16.98,40.62 XB1.10 15.84,41.77 13.92,41.77 10.24,45.45 10.24,49.49 10.46,49.72 10.46,52.94 9.35,54.06 J11.2 6.99,56.45 6.99,56.93 3.29,60.62 2.12,60.62 1.84,60.9 1.7,60.9 U$1.1
  Bottom 0.152: Y1.2 22.38,59.93 | 22.38,59.93 22.28,59.93 22.28,60.16 v21.39,61.05 | J13.4 29.24,31.51 26.8,31.51 26.16,32.14 26.16,35.57 23.72,37.91 23.72,38.01 | 22.4,72.76 22.4,73.03 21.77,73.5 v20.27,73.5
  Bottom 0.406: J6.2 3.79,50.66 J17.8
MISO  (via drill 0.3)
  Top 0.152: v34.14,60.26 33.07,60.26 U5.11 | v37.41,60.87 v35.66,60.87 | v35.2,35.11 35.2,44.49 38.35,47.63 40.08,47.63 v41.58,49.13
  Bottom 0.152: v34.14,60.26 35.05,60.26 v35.66,60.87 | 37.41,62.34 37.41,68.13 36.27,69.25 36.27,73.06 35.36,73.97 34.9,73.97 J1.7 | 37.41,62.34 v37.41,60.87 | J13.1 28.19,35.42 29.26,34.35 32.31,34.35 33.38,35.42 34.9,35.42 v35.2,35.11 | v41.58,49.13 41.55,59.19 39.5,61.27 38.86,61.88 38.41,62.34 37.41,62.34
MOSI  (via drill 0.3)
  Top 0.152: v34.14,64.37 34.9,63.61 34.9,60.11 v34.14,59.5 33.07,59.5 U5.10 | v32.56,32.95 32.54,38.03 32.28,38.29 32.28,43.09 v32.16,43.19
  Bottom 0.152: v34.14,64.37 33.53,64.98 33.53,68.79 34.29,69.56 34.75,69.56 J1.3 | v32.56,32.95 30.43,32.96 | 30.43,32.96 30.3,32.95 | v32.16,43.19 32.16,49.74 30.81,51.12 30.53,51.39 30.53,57.26 32.77,59.5 v34.14,59.5 | J13.5 30.43,32.96
N$1
  Top 0.152: R4.2 44.65,80.99 46.79,80.99 K1.2
N$2
  Top 0.152: J15.5 14.2,40.8 14.2,43.24 J15.6
N$3
  Top 0.152: D9.+ 15.09,65.29 16.31,65.29 16.61,64.98 R28.1
N$4
  Bottom 0.152: SJ4.1 37.53,46.84 38.3,47.61 39.67,47.61 40.13,48.07 40.13,51.83 39.29,52.67 XB1.17
N$5
  Top 0.152: D13.+ 16.16,59.65 17.22,59.65 18.44,58.43 R32.1 19.05,58.43
N$6
  Bottom 0.152: SJ2.1 38.47,49.13 XB1.15
N$7
  Bottom 0.152: XB1.20 38.77,58.67 37.57,57.46 37.57,52.92 SJ2.3
N$8
  Top 0.152: U2.2 39.32,75.04 39.32,70.78 39.17,70.62 39.17,68.03 R2.1
N$9
  Bottom 0.152: U1.1 19.97,70.78 19.97,71.84 20.27,72.15 X1.1
N$10
  Bottom 0.152: 21.34,70.78 U1.2 21.39,70.81 21.39,72.82 21.29,72.92 20.08,72.92 19.72,73.28 19.72,73.9 20.32,74.5 X1.2
N$11  (via drill 0.3)
  Top 0.152: v31.65,57.16 31.65,59.55 30.66,59.55 v30.12,60.08 | v30.81,65.49 30.81,67.14 31.55,67.88 31.55,68.18 C15.2
  Bottom 0.152: v31.65,57.16 31.42,56.85 31.14,56.58 31.14,51.73 36.12,46.7 36.58,46.7 SJ4.2 | v30.12,60.08 29.08,61.12 29.08,63.1 29.29,63.31 29.29,64.7 28.8,65.19 28.8,66.35 29.26,66.81 29.59,66.81 30.07,66.33 30.07,65.69 30.28,65.49 v30.81,65.49
N$12  (via drill 0.3)
  Top 0.152: U5.16 27.98,61.01 v27.97,60.97
  Bottom 0.152: 27.92,61 v27.97,60.97 27.97,60.79 27.13,59.95 24.18,59.95 24.03,59.8 24.03,58.81 23.93,58.71 22.93,58.71 Y1.3
N$13  (via drill 0.3)
  Top 0.152: v26.32,57.67 26.32,59.65 25.15,60.82 v24.94,60.82 | v24.41,63.26 24.08,63.26 23.19,64.12 v23.01,64.12 | D11.+ 21.59,70.65 22.51,69.73 22.51,67.85 v22.61,67.75
  Bottom 0.152: BAT2.+ 27.94,57.67 v26.32,57.67 | v24.94,60.82 24.41,61.68 v24.41,63.26 | v23.01,64.12 21.87,64.12 21.87,67.4 22.2,67.73 22.58,67.73 v22.61,67.75
N$14
  Top 0.152: R14.1 41.9,70.84 R6.2
N$15
  Top 0.152: D2.+ D7.+ 40.77,80.88 R4.1 42.67,80.99 42.52,81.14
N$16
  Top 0.152: D5.+ 37.19,73.82 37.19,74.89 34.44,77.63 33.83,77.63 31.85,79.61 J5.2
N$17
  Top 0.152: R7.2 R11.1
N$18  (via drill 0.3)
  Top 0.152: R3.2 25.91,45.17 23.93,45.17 Q1.1 23.78,45.32 23.78,45.63 21.64,47.76 19.36,47.76 19.05,47.46 19.05,46.39 19.2,46.24 20.57,46.24 21.03,45.78 21.03,44.56 20.12,43.65 16.61,43.65 16.16,43.19 v15.82,43.09
  Bottom 0.152: v15.82,43.09 15.7,43.22 15.7,48.95 14.97,49.67 12.31,49.67 11.47,50.51 11.47,54.68 12.05,55.26 14.01,55.26 SJ3.2 14.54,54.23 14.48,54.16 14.48,54.62 SJ3.2
N$19
  Top 0.152: 2.74,77.33 1.22,78.85 SW2.COM1 | 2.74,77.33 2.74,75.04 2.29,74.59 2.29,73.5 Q3.2 2.42,71.38 3.87,71.38 C1.2 5.63,70.57 D3.- | J7.2 6.55,79.61 4.57,77.63 3.05,77.63 2.74,77.33
N$20  (via drill 0.3)
  Top 0.152: U3.11 11.13,68.03 11.13,68.34 U3.12 | 11.28,67.88 U3.11 | v3.35,73.82 3.66,73.82 7.93,78.09 10.06,78.09 10.97,79 | 10.97,79 11.58,79.61 J7.1 10.97,79 | 10.97,79 7.62,82.36 4.12,82.36 3.2,81.44 1.22,81.44 SW2.CH1A | U3.11 11.16,67.9 11.84,67.9 12.47,67.27 12.95,67.27 C31.+ 12.95,66.32 10.62,63.99 v9.89,63.99
  Bottom 0.152: v3.35,73.82 3.35,73.67 7.32,69.71 7.32,66.56 v9.89,63.99
N$21  (via drill 0.3)
  Top 0.152: v20.57,61.05 21.44,61.91 21.44,64.37 23.6,66.53 23.6,67.65 24,68.06 25.48,68.06 26.06,68.64 26.06,69.45 v26.95,70.34
  Bottom 0.152: R8.1 32.61,66.66 32.61,68.64 Q5.1 32.77,68.79 31.7,69.86 30.53,69.86 30.05,70.34 v26.95,70.34 | v20.57,61.05 20.57,60.82 17.4,57.64 16.23,57.64 16,57.41 14.78,57.41 14.55,57.19 14.55,56.54 SJ1.2
N$22  (via drill 0.3)
  Top 0.152: Q8.3 4.77,59.62 C30.2 7.33,58.73 8.45,59.85 9.57,59.85 v9.59,59.87
  Bottom 0.152: v9.59,59.87 12.36,59.87 13.39,60.9 17.66,60.9 U$1.16
N$23
  Top 0.152: C20.2 17.53,68.03 16.76,68.79 16.76,69.88 17.17,70.29 20.04,70.29 20.22,70.47 20.22,72.43 20.86,73.07 20.86,73.67 20.22,74.31 20.22,75.5 20.78,76.06 22.96,76.06 24.98,78.07 27.59,78.07 27.88,77.78 32.46,77.78 34.75,75.5 34.75,72.91 U7.5
N$24
  Top 0.152: U7.1 33.83,70.32 32.41,70.32 29.21,73.52 28.5,73.52 | D8.+ 26.67,74.74 27.28,74.74 28.5,73.52 | 28.5,73.52 L3.2
N$25  (via drill 0.3)
  Top 0.152: 24.99,72.15 24.99,73.21 R20.1 | 24.99,72.15 24.99,71.23 | 24.99,71.23 C21.1 | v21.95,69.25 21.34,69.25 R21.2 | 24.99,72.15 v25.1,72.15 | 24.99,71.23 26.29,71.23 27.23,72.17 30.1,72.17 32.82,69.45 35.66,69.45 35.66,70.1 U7.3
  Bottom 0.152: v21.95,69.25 23.7,69.25 24.23,69.78 25.58,69.78 25.88,70.09 25.88,71.36 v25.1,72.15 25.07,72.15
N$26
  Bottom 0.152: 26.98,75.19 28.35,75.19 R22.1 | 26.98,75.19 26.21,75.19 Q2.1 | 26.98,75.19 26.98,72.5 27.59,72.07 27.84,72.02 SJ5.2
N$27
  Top 0.152: J20.4 14.05,16.57 14.05,17.31 9.93,21.42 9.93,23.28 8.87,24.34 J16.3
N$28
  Top 0.152: J20.3 14.05,14.13 14.05,14.84 9.93,18.96 9.93,20.84 8.87,21.9 J16.2
N$29
  Top 0.152: D14.+ 16.61,57.67 17.22,57.67 17.83,57.06 17.83,55.71 18.49,55.05 18.97,55.05 19.05,55.08 R33.2
N$30
  Top 0.152: J16.1 12.88,15.3 12.88,13.29 14.05,12.13 14.05,11.54 J20.2
N$31
  Bottom 0.152: J12.3 10.24,44.61 10.24,42.63 14.05,38.82 14.05,38.21 J15.4
N$32
  Top 0.152: J15.3 14.05,35.62 14.05,36.2 10.24,40.01 10.24,42.17 9.17,43.24 J12.2
N$33  (via drill 0.3)
  Top 0.152: v22.61,66.81 21.34,66.81 21.34,67.12 R24.1 | v33.22,63.61 33.22,62.21 31.65,60.64 v31.65,60.08 | U5.33 21.38,51.99 20.96,51.57 v20.09,51.57 | v23.85,54.44 25.68,54.44 26.16,54.93 27.43,54.93 v30.43,57.92
  Bottom 0.152: v22.61,66.81 23.47,67.68 24.05,67.68 24.36,67.98 25.1,67.98 25.6,67.47 28.12,67.47 29.01,68.36 29.35,68.71 30.18,69.56 31.55,69.56 31.7,69.4 31.7,65.44 31.4,65.14 31.4,63.48 31.57,63.31 32.92,63.31 v33.22,63.61 | v31.65,60.08 31.65,58.81 30.76,57.92 v30.43,57.92 | v20.09,51.57 20.32,51.55 22.78,53.98 23.39,53.98 v23.85,54.44
N$34  (via drill 0.3)
  Top 0.152: U5.3 32.99,53.86 33.76,53.86 35.51,55.64 v35.51,55.89 | v36.98,56.42 38.2,57.64 39.83,57.64 43.51,61.33 v43.51,63.15 | v12.12,74 12.95,73.26 R31.2
  Bottom 0.152: v35.51,55.89 36.04,56.42 v36.98,56.42 | v43.51,63.15 46.66,66.28 46.66,79.18 43.19,82.64 19.27,82.64 12.12,75.5 v12.12,74
N$35
  Top 0.152: C9.1 40.69,65.59 40.69,62.62 35.03,56.96 35.03,56.7 34.54,56.22 33,56.22 U5.6 33.07,56.22
N$36
  Top 0.152: J8.1 19.58,77.75 19.58,76.58 18.69,76.58 18.63,76.53 18.22,76.12 15.92,76.12 15.29,75.49 F2.1
N$37
  Top 0.152: D6.+ 15.09,63.76 15.7,63.76 16.61,62.85 R15.2
N$38
  Top 0.152: J15.2 14.05,33.18 14.05,34.05 9.93,38.16 9.93,38.52 9.17,39.28 9.17,40.65 J12.1
N$39
  Top 0.152: J20.5 14.2,19.16 14.2,21.6 J20.6
N$41  (via drill 0.3)
  Top 0.152: Q8.1 3.01,60.51 | 3.01,60.51 3.59,60.51 4.38,61.31 5.73,61.31 6.51,62.09 6.51,62.89 R17.1 | v12.7,57.92 12.69,57.93 12.43,58.18 10.5,58.18 10.22,57.9 10.17,57.9 10.15,57.92 8.22,57.92 8.19,57.93 3.64,57.93 3.11,58.46 3.11,60.41 3.01,60.51
  Bottom 0.152: SJ8.2 13.06,58.28 v12.7,57.92
N$42  (via drill 0.3)
  Top 0.152: v9.45,73.21 10.67,73.21 R19.2 | v44.35,63.15 44.35,60.39 39.62,55.64 37.85,55.64 37.52,55.31 37.52,53.65 35.43,51.57 32.31,51.57 31.85,52.03 31.85,54.16 32.31,54.62 32.92,54.62 U5.4
  Bottom 0.152: v9.45,73.21 10.21,73.21 10.21,74.36 18.85,82.98 43.69,82.97 47.02,79.69 47.02,65.39 44.78,63.15 v44.35,63.15
N$43
  Bottom 0.152: 16.92,43.01 16,43.93 16,51.06 14.53,52.54 SJ6.2 14.63,52.94 | 16.92,43.01 16.92,42.67 | XB1.9 16.94,42.71 16.92,43.01
N$44
  Top 0.152: U3.4 8.08,66.97 6.71,66.97 R23.1
N$46
  Top 0.152: D15.+ 16.61,60.72 R9.2
N$47  (via drill 0.3)
  Top 0.152: J23.1 18.11,34.35 v18.11,33.08
  Bottom 0.152: J17.3 1.55,35.62 7.8,29.37 17.86,29.35 18.29,29.78 18.29,32.9 v18.11,33.08
N$48  (via drill 0.3)
  Top 0.152: v12.07,31.61 14.89,31.61 15.29,32.01 15.29,36.1 16.31,37.12 17.63,37.12 19.38,35.37 J23.2
  Bottom 0.152: v12.07,31.61 9.53,31.61 2.97,38.16 J17.4
N$49
  Bottom 0.152: J17.5 1.55,40.65 10.19,31.99 11.15,31.99 11.38,32.22 12.95,32.22 13.18,31.99 15.19,31.99 17.3,33.77 20.6,33.77 J23.3
N$50
  Bottom 0.152: J23.4 24.49,35.37 22.96,36.89 7.77,36.92 J17.6
N$51
  Top 0.152: U3.9 11.13,66.81 11.13,65.82 9.95,64.65 C33.2 8.95,64.52 C34.2 8.94,63.18 C36.2
N$52
  Top 0.152: U3.3 8.23,67.42 8.23,67.88 U3.2 | U3.1 8.23,68.34 8.23,68.03 U3.2 | L1.1 5.06,67 5.94,67.88 8.08,67.88 U3.2
N$53  (via drill 0.3)
  Top 0.152: 17.3,30.77 17.27,30.79 17.04,30.79 J22.1 17.17,27.8 v17.02,27.65
  Bottom 0.152: J21.3 1.45,14.87 3.3,16.72 8.26,16.72 9.93,18.4 9.93,19.14 13.77,22.95 14.58,22.95 15.42,23.79 15.42,25 15.49,25.1 17.02,26.6 v17.02,27.65
N$54  (via drill 0.3)
  Top 0.152: v18.82,28.26 19.71,29.14 J22.2
  Bottom 0.152: J21.4 1.55,16.57 5.51,20.53 9.02,20.53 12.73,24.24 12.73,24.5 13.49,25.26 14.4,25.26 15.32,26.17 15.32,27.59 15.98,28.26 v18.82,28.26
N$55  (via drill 0.3)
  Top 0.152: J21.5 3.73,16.82 v4.22,15.46 | v21.82,28.03 22.25,28.46 J22.3
  Bottom 0.152: v4.22,15.46 8.1,16.11 12.32,20.33 14.81,20.33 15.82,21.35 15.82,24.88 17.91,27.01 18.26,27.37 18.8,27.37 19.46,28.03 v21.82,28.03
N$56
  Bottom 0.152: J21.6 2.77,22.97 8.87,22.97 14.91,29.02 22.86,28.99 J22.4
N$57
  Top 0.152: R16.2 24.99,43.49 26.82,43.49 Q4.1
N$58
  Top 0.152: Q4.3 D10.A 29.11,39.81 29.21,39.71 29.21,29.4 29.88,28.73 SW1.3 30.02,25.05
N$61
  Top 0.152: 23.93,4.18 J19.2
  Top 1.27: 23.93,4.18 23.93,26.88 SW1.1
N$63  (via drill 0.3)
  Top 0.152: U3.13 10.52,69.1 v11.43,69.1 11.43,69.01 12.33,68.1 13.67,68.1 13.84,68.28 13.84,70.05 13.23,70.66 C32.1 | v11.74,66.35 11.89,66.51 11.89,67.12 11.58,67.42 11.28,67.42 U3.10
  Bottom 0.152: v11.74,66.35 11.74,68.79 v11.43,69.1
N$77  (via drill 0.3)
  Top 0.152: v27.18,61 U5.17
  Bottom 0.152: Y1.1 23.64,61.13 24.49,60.28 26.47,60.28 v27.18,61
N$80  (via drill 0.3)
  Top 0.152: v41.45,61.93 40.95,61.93 36.45,57.44 v36.45,54.65 | v33.38,50.61 33.38,49.87 32.05,48.55 30.91,48.55 29.72,49.74 29.72,50.35 U5.42 | 42.52,69.71 C6.1 44.11,70.95 v44.11,71.04
  Bottom 0.152: v44.11,71.04 44.12,69.48 43.13,68.5 43.13,68.49 40.87,66.23 40.87,62.52 v41.45,61.93 | v33.38,50.61 33.35,52.66 33.73,53.04 34.85,53.04 v36.45,54.65
NC1
  Top 0.152: 29.87,12.71 SW1.5
  Top 1.27: J19.3 28.91,11.77 29.87,12.71
NO1
  Top 1.27: J19.1 18.75,4.18 18.75,11.95 17.98,12.71 SW1.4
OK
  Top 0.152: U2.6 39.93,78.09 39.93,79.16 D7.- 40.8,79.49 41.03,79.72 44.7,79.72 45.95,78.47 49.28,78.47 49.53,78.22 49.53,76.36 49.25,76.08 48.34,76.09 48.34,76.08 48.17,75.91 48.16,75.92 48.16,73.99 48.72,73.42 48.72,72.27 R12.1
PAP1_3V3
  Top 0.152: J16.4 J16.5 | J16.5 J16.6 | C27.2 J16.5
PAP2_3V3
  Top 0.152: 3.53,40.8 C11.2 6.43,40.8 J12.6 6.58,40.8 6.58,43.24 | 6.58,43.24 6.58,45.68 J12.4 | 6.58,43.24 J12.5
RELAIS  (via drill 0.3)
  Top 0.152: v22.71,44.87 23.32,44.26 23.32,43.65 R16.1 | 24.79,53.3 v24.77,53.4 24.33,53.83 23.6,53.83 22.71,54.72 22.71,56.3 22.1,56.91 21.49,56.91 U5.27 20.74,57.05 20.24,57.54 20.24,60.03 19.66,60.62 19.66,61.6 R15.1
  Bottom 0.152: v22.71,44.87 22.71,51.29 23.72,52.31 23.72,52.99 24,53.27 24.64,53.27 v24.77,53.4
RESET  (via drill 0.3)
  Top 0.152: v34.14,66.35 33.53,66.97 33.53,68.18 C15.1 | U5.13 30.48,62.09 30.48,62.7 30.99,63.2 31.7,63.2 33.63,65.14 v34.14,65.14 37.77,61.5 v38.08,61.5 | J13.3 26.37,31.81 26.34,36.31 26.95,36.97 26.98,40.6 26.67,40.9 26.21,40.9 25.76,41.36 23.62,41.36 R30.1
  Bottom 0.152: v34.14,65.14 v34.14,66.35 | v38.08,61.5 38.05,61.55 38.66,61.55 40.97,59.24 40.97,58.66 41.12,23.63 40.51,23.02 39.78,23 39.14,23.66 39.14,24.39 36.86,26.68 29.79,26.68 28.35,28.13 28.35,29.88 J13.3
RTC_3V3  (via drill 0.3)
  Top 0.152: 19.34,74.9 D12.- | v20.57,63.76 20.27,64.07 20.27,69.86 20.57,70.16 20.58,72.34 21.64,73.4 21.64,74.89 D11.- | v26.95,66.1 v26.95,68.03 | D12.- 19.23,74.68 19.2,74.66 19.2,74.68 | 19.23,74.92 D12.- | v19.1,75.74 19.1,74.78 D12.-
  Bottom 0.152: C7.2 22.4,74.74 21.18,75.96 20.77,76.37 19.64,76.37 v19.1,75.74 19.1,73.93 18.84,73.67 16.61,73.67 16.46,73.52 16.46,70.16 16.92,69.71 18.9,69.71 20.32,68.31 26.67,68.31 v26.95,68.03 | U1.8 19.97,65.14 20.27,64.83 20.27,64.07 v20.57,63.76 21.34,63 22.86,63 24.23,64.37 25.3,64.37 | 25.3,64.37 C10.2 | v26.95,66.1 26.9,65.97 25.3,64.37
RX  (via drill 0.3)
  Top 0.152: v22.33,63.54 23.09,63.54 23.93,62.7 23.93,62.09 U5.21 | v14.17,61.52 14.17,58.89 16.31,56.75 16.92,56.75 16.92,56.67 XB1.2
  Bottom 0.152: v22.33,63.54 21.57,63.54 20.57,64.53 20.57,66.05 20.42,66.2 19.2,66.2 18.75,65.75 | 18.75,65.75 16.61,65.75 16.31,65.44 13.96,65.44 | 13.96,65.44 11.43,65.44 7.62,69.25 7.62,69.86 3.96,73.52 3.96,73.97 3.2,74.74 1.68,74.74 U$1.8 | 18.75,65.75 19.05,65.44 | v14.17,61.52 14.17,65.23 13.96,65.44
S1  (via drill 0.3)
  Top 0.152: v23.85,55.33 23.24,55.94 23.24,56.52 21.95,57.82 21.49,57.82 U5.26 | v19.25,41.26 18.9,41.26 17.04,39.41 13.74,39.41 10.24,42.91 10.24,47.1 7.24,50.1 7.24,55.15 8.71,56.63 J11.3 | 19.28,41.26 v19.25,41.26 | 19.05,41.26 v19.25,41.26
  Bottom 0.152: v19.25,41.26 19.3,41.26 19.36,41.31 19.36,48.37 23.42,52.44 23.42,53.12 24.44,54.14 24.44,55.08 24.18,55.33 v23.85,55.33
S2  (via drill 0.3)
  Top 0.152: U5.25 22.19,58.65 22.53,58.3 22.53,57.72 v23.85,56.4 | v16.28,53.6 15.52,53.6 15.51,53.62 15.51,53.64 13.08,56.06 J14.3
  Bottom 0.152: v23.85,56.4 19.58,56.4 18.52,55.33 18.52,54.34 17.76,53.58 16.31,53.58 v16.28,53.6
SCK  (via drill 0.3)
  Top 0.152: v34.14,58.73 33.07,58.73 U5.9
  Bottom 0.152: J1.5 34.9,71.84 35.2,71.84 35.97,71.08 35.97,69.1 36.88,68.18 36.88,60.56 35.05,58.73 v34.14,58.73 32.49,58.73 31.12,57.39 30.84,57.11 30.84,51.55 31.12,51.27 32.46,49.9 32.46,45.17 39.02,38.59 39.02,34.05 38.41,33.44 33.38,33.44 32.77,34.05 29.26,34.05 28.19,32.98 27.99,32.95 J13.2
SCL  (via drill 0.3)
  Top 0.152: 28.04,64.37 28.04,64.83 | 28.04,64.83 R26.2 | 26.52,62.09 U5.18 | R26.2 28.04,64.98 28.04,64.83 | J10.1 34.14,5.7 34.11,10.42 J4.1 34.09,12.74 31.7,15.12 31.65,15.2 | U5.18 26.52,61.93 26.52,60.59 27.03,60.08 v28.6,60.08 | v24.69,67.42 24.87,67.42 27.25,65.03 | U5.18 26.38,63.32 26.59,63.54 26.59,64.47 27.15,65.03 27.25,65.03 | 27.25,65.03 27.92,65.03 R26.2 | v30.96,39.35 30.99,39.33 30.99,37.4 31.65,36.74 31.65,15.2 | 31.65,15.2 31.67,15.17
  Bottom 0.152: v24.69,67.42 24.41,67.14 23.7,67.14 22.4,65.85 U1.6 | v30.96,39.35 29.97,40.32 29.95,47.46 29.49,47.94 29.49,48.96 29.21,49.23 29.21,59.47 v28.6,60.08 | J4.1 34.04,12.81 31.91,14.93 16.12,14.93 15.39,14.21 15.39,6.02 13.27,3.89 JP5.4
SD_3V3
  Bottom 0.152: 31.85,70.78 31.85,72.6 C18.2 | 31.85,70.78 34.75,70.78 J1.4 | 31.85,70.78 Q5.3
SD_EN  (via drill 0.3)
  Top 0.152: 19.05,53.4 18.9,53.55 | 19.05,53.4 20.27,54.62 21.34,54.62 U5.30 | 19.05,53.4 R33.1 17.83,54.26 17.83,55.08 17.22,55.69 v16.26,55.69
  Bottom 0.152: SJ1.1 15.65,56.52 v16.26,55.69 16.41,55.74
SDA  (via drill 0.3)
  Top 0.152: 25.76,64.83 25.76,62.24 25.6,62.09 U5.19 25.6,61.93 25.6,61.48 25.58,61.45 25.58,60.97 27.51,59.04 30.12,59.04 v30.12,59.01 | 25.76,64.83 R27.2 | J10.2 36.12,5.7 36.12,10.45 J4.2 36.09,12.76 33.07,15.76 33.07,17.79 36.48,21.19 36.48,21.24 37.16,21.93 37.16,27.49 36.53,28.13 33.25,28.13 33.1,28.28 33.1,38.59 32.94,38.74 v32.94,38.77 | 25.76,64.83 25.73,64.86 25.73,65.8 24.87,66.66 v24.69,66.66
  Bottom 0.152: 23.62,65.14 U1.5 23.75,66.18 24.23,66.66 v24.69,66.66 | v30.12,59.01 30.12,58.61 29.9,58.38 29.9,50.68 30.15,50.43 30.15,48.17 30.58,47.74 30.61,41.11 v32.94,38.77 | J4.2 36.02,12.81 33.47,15.37 13.45,15.37 9.55,11.47 JP5.3
SERVO_EN  (via drill 0.3)
  Top 0.152: v32.61,76.87 v31.7,75.96 | v33.98,78.24 34.59,78.24 v37.03,75.8 | v28.88,28.53 28.88,37.78 27.74,38.92 27.74,42.28 27.59,42.43 v24.84,42.43 | R9.1 18.44,60.72 19.1,60.72 19.91,59.9 19.91,57.03 20.65,56.3 21.33,56.3 U5.28 21.49,56.14 22.1,56.14 22.4,55.84 22.4,54.59 24.44,52.56 v24.77,52.56 | v36.45,27.42 36.45,25.54 v36.58,25.38
  Bottom 0.152: v31.7,75.96 32.77,74.89 32.77,73.82 32.61,73.67 31.24,73.67 28.6,71.03 27.99,71.03 SJ5.1 | v33.98,78.24 v32.61,76.87 | v37.03,75.8 37.03,68.95 39.02,66.97 39.02,63.31 44.5,57.82 44.5,48.37 41.48,45.32 41.53,23.58 40.51,22.56 38.2,22.56 37.14,23.63 37.16,24.8 v36.58,25.38 | v24.77,52.56 24.71,52.56 24.84,52.44 v24.84,42.43 | v28.88,28.53 35.31,28.56 v36.45,27.42
SS  (via drill 0.3)
  Top 0.152: v35.66,60.11 35.66,58.89 34.92,58.15 33.25,58.15 U5.8
  Bottom 0.152: v35.66,60.11 36.58,61.02 36.58,67.27 35.36,68.49 34.9,68.49 J1.2
STEP1  (via drill 0.3)
  Top 0.152: v22.81,52.71 22.58,52.94 21.49,52.94 U5.32 | v19.25,39.99 20.93,38.31 20.93,34.81 18.41,32.29 16.43,32.29 15.85,31.71 15.85,29.83 16.16,29.52 v16.16,27.65
  Bottom 0.152: v22.81,52.71 22.81,52.31 18.54,48.02 18.54,40.75 19.3,39.99 v19.25,39.99 | 14.2,24.19 J20.7 16.16,26.2 v16.16,27.65
STEP2
  Top 0.152: U5.31 21.34,53.71 20.57,53.71 20.12,53.25 20.12,52.49 17.22,49.59 16.46,49.59 15.24,48.37 15.24,47.3 14.15,46.21 J15.7
TX  (via drill 0.3)
  Top 0.152: v9.59,59.04 12.5,59.04 15.27,56.27 15.27,55.23 15.88,54.62 16.94,54.62 XB1.3 | 24.69,61.96 U5.20 24.74,62.01 24.74,61.38 24.38,61.02 v24.38,57.67
  Bottom 0.152: U$1.7 1.68,72.76 3.66,72.76 7.01,69.4 7.01,62.72 7.61,62.13 7.61,59.58 8.15,59.04 v9.59,59.04 | 19.97,57.67 v24.38,57.67 | 19.97,57.67 19.97,57.66 | 19.97,57.67 19.94,57.67 XB1.3
USB_TF  (via drill 0.3)
  Top 0.152: v34.19,57.62 34.04,57.36 33.2,57.36 33.1,57.26 U5.7 | U5.2 33.07,53.1 34.19,53.1 35.54,54.44 v35.54,54.65 36.04,55.15 36.04,57.49 41.83,63.28 41.86,63.28 v41.86,64.32
  Bottom 0.152: v41.86,64.32 46.33,68.79 46.33,78.4 42.42,82.31 20.98,82.31 20.42,81.75 20.42,81.44 11.58,72.6 9.3,72.6 8.84,73.06 8.84,73.21 4.57,77.48 4.57,78.85 SW2.COM2 | v34.19,57.62 34.54,57.62 34.87,57.29 34.87,55.31 v35.54,54.65
V_BAT  (via drill 0.3)
  Top 0.152: R13.1 42.22,75.04 42.22,73.37 C13.1 42.29,72.12 R14.2 41.92,71.59 41.27,70.94 41.27,70.8 41.28,70.8 41.28,69.43 v40.36,68.51 | v40.06,63.05 40.06,62.49 34.39,56.83 v34.19,56.83 | v28.65,51.39 28.65,50.55 U5.41 | v31.67,56.14 30.33,56.14 28.4,54.21 v27.23,54.21
  Bottom 0.152: v40.36,68.51 40.36,63.36 v40.06,63.05 | v28.65,51.39 27.2,51.39 26.85,51.85 26.85,53.83 v27.23,54.21 | v34.19,56.83 32.36,56.83 v31.67,56.14
V_BOOST  (via drill 0.3)
  Top 0.152: C19.+ 17.25,74.74 17.27,74.74 18.81,76.27 20.02,76.27 20.59,76.84 v22.51,76.84 23.29,76.84 24.84,78.4 v28.19,78.4 | U7.6 33.83,72.91 33.83,74.74 R18.1 33.02,73.9 L3.1 31.4,73.92 31.4,74.79 30.79,75.4 v30.79,75.96
  Bottom 0.152: v30.79,75.96 30.63,75.96 v28.19,78.4 | Q2.3 24.13,74.84 22.53,76.44 22.53,76.82 v22.51,76.84
V_SERVO  (via drill 0.3)
  Top 0.152: v35.97,64.35 35.97,64.22 36.12,64.07 37.49,64.07 C22.2 | v34.14,62.7 v34.14,61.48 | v29.41,66.13 28.8,66.74 28.8,67.12 C25.+ 28.68,68.21 27.72,68.21 26.95,68.98 v26.95,69.22 | v23.47,72.15 23.47,73.29 R20.2 23.32,73.37 23.32,74.74 D8.- | v23.47,72.15 23.47,71.23 C21.2 23.32,71.23 23.32,69.25 C23.2 23.27,68.79 23.17,68.69 23.17,66.58 21.13,64.55 21.13,63.15 v20.57,62.6 | v23.47,72.15 23.47,73.31 23.22,73.31 | J14.1 J11.1 8.88,51.55 8.01,52.42 8.01,54.75 8.6,55.34 10.04,55.34 10.76,56.05 10.76,57.32 10.86,57.42 10.86,57.43 v10.82,57.46
  Bottom 0.152: 30.02,63 30.02,64.07 30.33,64.37 | 30.02,63 30.02,62.09 C26.+ | v35.97,64.35 36.27,64.04 36.27,61.78 35.97,61.48 v34.14,61.48 | v34.14,62.7 33.53,62.7 33.22,63 30.02,63 | v29.41,66.13 29.41,65.29 30.33,64.37 | 30.33,64.37 C24.2 | v23.47,72.15 24.08,72.76 25.35,72.76 26.34,71.76 26.34,69.73 26.85,69.22 v26.95,69.22 | v20.57,62.6 20.57,61.93 19.61,60.97 19.61,60.28 18.34,59.01 17.86,59.01 17.3,59.57 12.5,59.55 10.87,57.74 10.8,57.59 v10.82,57.46
VEXT
  Top 0.152: 7.04,8.95 7.8,9.71 C16.+ | 7.04,30.59 7.8,31.35 C17.+ | 1.55,30.59 J17.1 | 7.87,31.08 C17.+ | 7.04,30.59 7.54,30.29 | 7.04,30.59 C17.+
  Top 0.406: 7.04,8.95 J21.1 | 7.04,30.59 1.55,30.59 | J6.1 3.81,55.74 2.29,54.21 2.29,50.33 3.94,48.68 7.04,48.68 7.77,48.07 7.77,39.07 8.69,39.07 9.4,38.36 9.4,32.6 7.87,31.08 | C16.+ 7.8,11.95 9.25,13.4 9.25,16.7 7.54,18.48 7.54,30.29
VIN
  Top 0.152: C5.+ 40.23,70.01 40.23,71.84 40.39,71.99 D4.- 40.54,71.99 40.54,73.67 D5.- 40.39,73.82 40.39,75.04 U2.4 40.39,75.19 41,75.8 44.2,75.8 44.96,76.57 46.79,76.57 K1.1
VUSB  (via drill 0.3)
  Top 0.152: v3.51,77.1 3.51,75.35 2.74,74.59 2.74,73.67 2.75,72.48 Q3.1 | 12.3,72.1 12.11,72.29 10.63,72.29 9.78,71.44 D3.+ 9.78,71.62 8.43,72.97 8.43,74.23 C8.+ 8.41,74.31 v8.41,75.54 | 12.3,72.1 12.3,69.74 R5.2 | F2.2 15.09,71.56 14.39,72.27 12.46,72.27 12.3,72.1 | D4.+ 37.21,71.59 33.53,71.59 33.01,72.11 v33.01,73.03 | v22.97,81.41 21.72,82.66 v9.03,82.66
  Bottom 0.152: v3.51,77.1 3.51,80.38 SW2.CH2A | v8.41,75.54 5.71,78.24 5.71,80.06 4.48,81.29 SW2.CH2A | v33.01,73.03 33.01,73.19 33.24,73.42 33.24,75.35 27.18,81.41 v22.97,81.41 | SW2.CH2A 5.79,82.66 v9.03,82.66

## Text on the board
tPlace: + | ON | SD | + | 1 | 2 | ICSP | Grove 1 | Moteurs | Grove 2 | Grove 3 | Grove 4 | Grove 5
bPlace: + | BETA | _ | + | + | _ | + | _ | + | _ | + | _ | + | _ | + | NO | COM | NC
_bPlace: U$1
_tNames: J5 | D2 | D7 | R4 | SW2 | J8 | J9 | C14 | J7 | K1 | U2 | R13 | R10 | R19 | R31 | D8 | C8 | F1 | C19 | L3 | R18 | R20 | D5 | R11 | R12 | C1 | D11 | C13 | Q3 | D3 | D12 | C21 | U7 | D4 | C25 | C5 | R14 | R5 | C20 | C23 | C6 | C12 | R21 | C15 | R2 | U3 | C32 | R24 | L1 | R23 | C31 | C22 | D9 | R26 | C9 | R17 | C33 | C36 | D6 | R28 | R27 | XB1 | R15 | C34 | D15 | C35 | D13 | R9 | Q8 | C30 | D14 | R32 | J11 | J14 | JP7 | J6 | R33 | U5 | R3 | Q1 | C28 | C11 | J12 | R16 | Q4 | D1 | JP4 | R30 | R1 | D10 | C17 | J13 | J3 | JP3 | JP11 | JP6 | J2 | J16 | C27 | J18 | JP2 | SW1 | C16 | J4 | JP1 | J10 | JP5 | J19
_bNames: R22 | C18 | Q2 | X1 | C7 | SJ5 | Q5 | U1 | R8 | C10 | C24 | X2 | J1 | C26 | SJ8 | C4 | SJ1 | C3 | SJ3 | SJ6 | SJ2 | SJ4 | BAT2
_tFinish: D8 | D5 | D12 | D11 | D3 | C21 | D4 | C20 | C25 | C36 | C33 | C34 | C35
_bFinish: J1